# Altium schematic sheet TopSheet.SchDoc
size A4
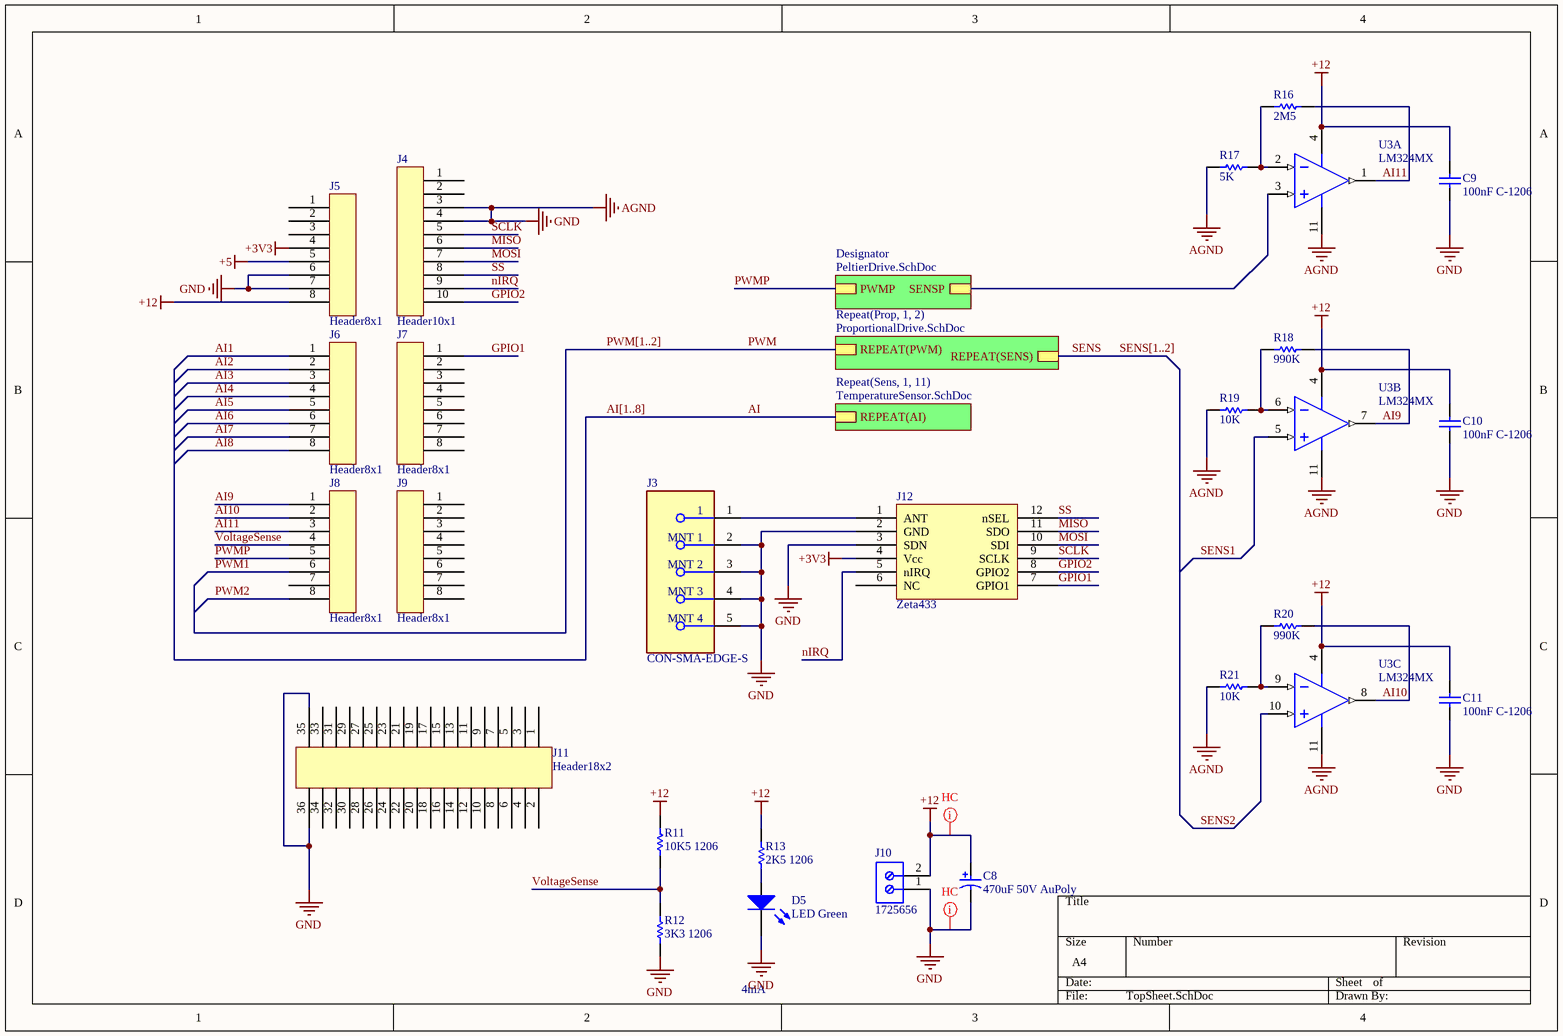
[diagram p0: TopSheet.SchDoc]

## Parts
C8  470uF 50V AuPoly  [CAPAE137130X163M]
C9  100nF C-1206  [C-1206]
C10  100nF C-1206  [C-1206]
C11  100nF C-1206  [C-1206]
D5  LED Green  [0603_A]
J3  CON-SMA-EDGE-S  [FP-CON-SMA-EDGE-S-MFG]
J4  Header10x1  [Header10x1]
J5  Header8x1  [Header8x1]
J6  Header8x1  [Header8x1]
J7  Header8x1  [Header8x1]
J8  Header8x1  [Header8x1]
J9  Header8x1  [Header8x1]
J10  1725656  [PHOE-1725656-2]
J11  Header18x2  [Header18x2]
J12  Zeta433  [Zeta433-SM]
R11  10K5 1206  [R-1206]
R12  3K3 1206  [R-1206]
R13  2K5 1206  [R-1206]
R16  2M5  [RESC0603(1608)_N]
R17  5K  [RESC0603(1608)_N]
R18  990K  [RESC0603(1608)_N]
R19  10K  [RESC0603(1608)_N]
R20  990K  [RESC0603(1608)_N]
R21  10K  [RESC0603(1608)_N]
U3  LM324MX  [D0014A_L]  (parts A,B,C of 4)

## Sub-sheets
Designator = PeltierDrive.SchDoc: PWMP, SENSP
Repeat(Prop, 1, 2) = ProportionalDrive.SchDoc: REPEAT(PWM), REPEAT(SENS)
Repeat(Sens, 1, 11) = TemperatureSensor.SchDoc: REPEAT(AI)

## Nets
+3V3: J5.4 J12.4(Vcc)
+5: J5.5
+12: C8.1 C9.2 C10.2 C11.2 J5.8 J10.2 R11.2 R13.2 U3.4(V+)
AGND: C8.2 C9.1 C10.1 C11.1 D5.1(K) J3.2(MNT_1) J3.3(MNT_2) J3.4(MNT_3) J3.5(MNT_4) J4.3 J4.4 J5.6 J5.7 J10.1 J11.35 J11.36 J12.2(GND) J12.3(SDN) R12.1 R17.1 R19.1 R21.1 U3.11(GND)  [also labelled GND]
AI: sheet Repeat(Sens, 1, 11)/REPEAT(AI)
AI1: J6.1
AI2: J6.2
AI3: J6.3
AI4: J6.4
AI5: J6.5
AI6: J6.6
AI7: J6.7
AI8: J6.8
AI9: J8.1 R18.2 U3.7(OUT2)
AI10: J8.2 R20.2 U3.8(OUT3)
AI11: J8.3 R16.2 U3.1(OUT1)
GPIO1: J7.1 J12.7(GPIO1)
GPIO2: J4.10 J12.8(GPIO2)
MISO: J4.6 J12.11(SDO)
MOSI: J4.7 J12.10(SDI)
nIRQ: J4.9 J12.5(nIRQ)
PWM: sheet Repeat(Prop, 1, 2)/REPEAT(PWM)
PWM1: J8.6
PWM2: J8.8
PWMP: J8.5 ; sheet Designator/PWMP
SCLK: J4.5 J12.9(SCLK)
SENS: sheet Repeat(Prop, 1, 2)/REPEAT(SENS)
SENS1: U3.5(IN2+)
SENS2: U3.10(IN3+)
SS: J4.8 J12.12(nSEL)
VoltageSense: J8.4 R11.1 R12.2
NetD5_2: D5.2(A) R13.1
NetJ3_1: J3.1 J12.1(ANT)
NetR16_1: R16.1 R17.2 U3.2(IN1-)
NetR18_1: R18.1 R19.2 U3.6(IN2-)
NetR20_1: R20.1 R21.2 U3.9(IN3-)
NetU3_3: U3.3(IN1+) ; sheet Designator/SENSP

Not connected (* = marked no-connect by the designer): J4 1 2; J5 1 2 3; J7 2 3 4 5 6 7 8; J8 7; J9 1 2 3 4 5 6 7 8; J11 1 2 3 4 5 6 7 8 9 10 11 12 13 14 15 16 17 18 19 20 21 22 23 24 25 26 27 28 29 30 31 32 33 34; J12 6(NC)

## Buses and harness runs
bus AI[1..8]
bus PWM[1..2]
bus SENS[1..2]

## Layout directives
net class HC: +12, AGND

## Notes on the sheet
- 4mA

## Library data of the parts
C8 = C-Poly: Manufacturer: AVX; DELETED: Compliant; Product Depth (mm): 4.3mm; Product Length (mm): 7.3mm; Case Style: Molded; Product Diameter (mm): NotRequiredmm; DF: 6%; Seal: NotRequired; Capacitance: 22000000pF; Product Height (mm): 2.9mm; Rad Hardened: No; ESR: 0.2ohm; Polarity: Polar; DCL: 5.5uA; Voltage: 25VDC; Tolerance (+ or -): 10%; Construction: SMTChip; Mounting Style: SurfaceMount; Packaging: TapeandReel; Case Code: D; Package Reference: 7343-31; Manufacturer URL: http://www.avx.com/; Failure Rate: NotRequired; Insulation: NotRequired; Operating Temp Range: -55Cto125C; Mounting Technology: SurfaceMount; Package Description: 2-Pin Surface Mount Device, Body 7.3 x 4.35 mm; Length W/Weld (max): NotRequiredmm; Lead Spacing (nom): NotRequiredmm; Seated Plane Height: NotRequiredmm; Wire Form: NotRequired; Datasheet Version: 02/2004; Datasheet URL: https://datasheet.ciiva.com/11793/0900766b80066cb4-11793194.pdf; Length W/Weld: NotRequiredmm; Package / Case: 7343-31
C9-C11 = C-1206: Ceramic 50V 1206; Case-EIA: 1206; Tolerance: Â±20%; Case-Metric: 3216; Max Thickness: 1 mm; Rated Voltage: 50 V; Value: 100nF; Technology: SMT
D5 = CMP-1426-00002-1: SMD mono-color Chip LED, WL-SMCW, Green; PartNumber: 150060GS75000; Manufacturer: Wuerth Elektronik; ComponentLink1URL: http://www.we-online.com; ComponentLink2Description: Datasheet; Color: Green; ComponentLink2URL: http://katalog.we-online.com/led/datasheet/150060GS75000.pdf; PackageReference: 0603_A; ComponentLink1Description: Manufacturer URL
J3 = CMP-204357-000001-1: CONN SMA JACK STR EDGE MNT; Manufacturer: RF Solutions Ltd.; Impedance: 50Ω; Conn Orientation: Right Angle; Is Female: yes; Number Of Contacts: 1; Frequency: 18GHz; Shielding: true; Category: Conn; ComponentLink2URL: https://www.rfsolutions.co.uk/downloads/1498648656DS-CON-EDGE-SMA-4.pdf; Octopart: https://octopart.com/con-sma-edge-s-rf+solutions-70967450; Package: CONN_JACK; Manufacturer Part Number: CON-SMA-EDGE-S; Height: 6.35mm; Device Class L1: Connectors; Footprint Url: https://forum.upverter.com/uploads/default/original/3X/b/e/be75b907af57498775929d6d9099689c472e0307.pdf; Contact Material: Gold; ComponentLink2Description: Datasheet; Device Class L2: RF / Coaxial Connectors; RoHS: TRUE; Device Class L3: unset; Digikey Description: CONN SMA JACK STR EDGE MNT; Lead Free: Yes; Automotive: No
J10 = CMP-2000-05299-1: Male Header, Pitch 2.54 mm, 1 x 2 Position, Height 9 mm, Tail Length 3.5 mm; Manufacturer: Phoenix Contact; Number of contacts: 2; Content: 250pc(s); Pitch: 2.54mm; Industrial packaging: Yes; Colour: Green; Manufacturer part No.: 1725656; Type: MPT0,5/2-2,54; Datasheet URL: http://datasheet.octopart.com/1725656-Phoenix-Contact-datasheet-5302866.pdf; Manufacturer URL: http://www.phoenixcontact.com/; Datasheet Version: Apr-08
R11-R13 = R-1206: 0.25W 1206; Power: 0.1 W; Value: 10000.00 Ohm; Tolerance: 1 %; Case-EIA: 0603; Case-Metric: 1608; Technology: SMT
R16-R21 = CMP-1012-00623-1: 10K 0.1W 1% 0603 (1608 Metric)  SMD; Value: 10000.00 Ohm; Case-EIA: 0603; Case-Metric: 1608; Power: 0.1 W; Tolerance: 1 %; Technology: SMT
U3 = CMP-0055-00741-3: Low Power Quad Operational Amplifier, 14-pin Narrow SOIC; Manufacturer: Texas Instruments; PowerWise: N; CompType: Amplifiers; PackageTopMarking: NSUZXYTTE#*LM324M; Package Reference: D0014A; ComponentLink1URL: http://www.ti.com/general/docs/lit/getliterature.tsp?genericPartNumber=LM324-N&fileType=pdf; PinCount: 14; PackageDescription: Molded Package S.O., .150in Wide, 14 Lead; Code_JEDEC: MS-012AB; Code_IPC: SOIC127P600-14; ComponentLink1Description: Datasheet URL; RoHS: N